# EAGLE design E-meter (EAGLE 7.4.0)
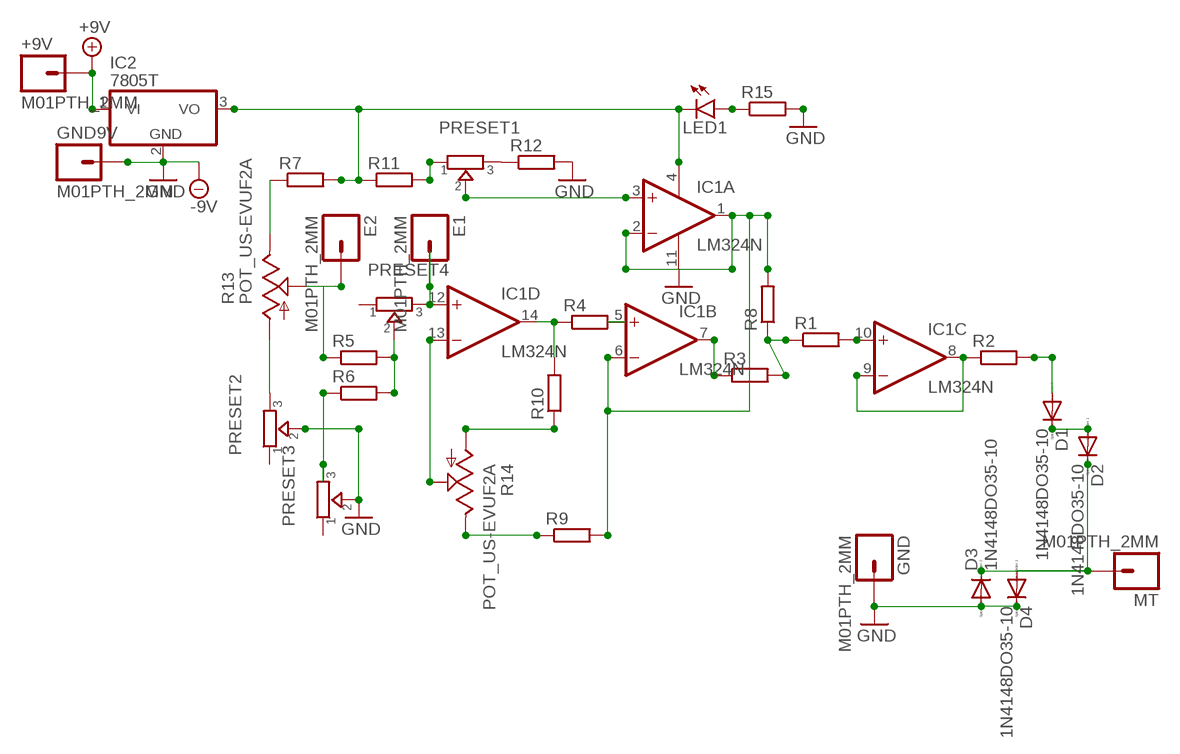
[diagram p0: schematic, sheet 1]

## Parts
+9V  M01PTH_2MM  [1X01_2MM]
D1  1N4148DO35-10  [DO35-10]
D2  1N4148DO35-10  [DO35-10]
D3  1N4148DO35-10  [DO35-10]
D4  1N4148DO35-10  [DO35-10]
E1  M01PTH_2MM  [1X01_2MM]
E2  M01PTH_2MM  [1X01_2MM]
GND  M01PTH_2MM  [1X01_2MM]
GND9V  M01PTH_2MM  [1X01_2MM]
IC1  LM324N  [DIL14]
IC2  7805T  [TO220H]
LED1  LED5MM  [LED5MM]
MT  M01PTH_2MM  [1X01_2MM]
PRESET1  TRIMMER-3306F  [TRIMMER_3306F]
PRESET2  TRIMMER-3306F  [TRIMMER_3306F]
PRESET3  TRIMMER-3306F  [TRIMMER_3306F]
PRESET4  TRIMMER-3306F  [TRIMMER_3306F]
R1  R-EU_0207/10  [0207/10]
R2  R-EU_0207/10  [0207/10]
R3  R-EU_0207/10  [0207/10]
R4  R-EU_0207/10  [0207/10]
R5  R-EU_0207/10  [0207/10]
R6  R-EU_0207/10  [0207/10]
R7  R-EU_0207/10  [0207/10]
R8  R-EU_0207/10  [0207/10]
R9  R-EU_0207/10  [0207/10]
R10  R-EU_0207/10  [0207/10]
R11  R-EU_0207/10  [0207/10]
R12  R-EU_0207/10  [0207/10]
R13  POT_US-EVUF2A  [POT_EVUF]
R14  POT_US-EVUF2A  [POT_EVUF]
R15  R-EU_0207/10  [0207/10]

## Nets
+9V: +9V.1 IC2.1(VI)
GND: D3.A D4.C GND9V.1 GND.1 IC1.11(P:V-) IC2.2(GND) PRESET2.2 PRESET3.2 R12.2 R15.2 ; supply symbol labelled -9V
N$1: E2.1 R5.1 R13.2(S)
N$2: IC1.10(C:+IN) R1.2
N$3: IC1.7(B:OUT) R3.1
N$4: IC1.1(A:OUT) IC1.2(A:-IN) IC1.6(B:-IN) R8.2 R9.2
N$5: IC1.5(B:+IN) R4.2
N$6: IC1.14(D:OUT) R4.1 R10.2
N$7: IC1.8(C:OUT) IC1.9(C:-IN) R2.1
N$8: D1.A R2.2
N$9: E1.1 IC1.12(D:+IN) PRESET4.3
N$10: D1.C D2.A
N$11: D2.C D3.C D4.A MT.1
N$12: IC1.3(A:+IN) PRESET1.2
N$13: PRESET1.1 R11.2
N$14: IC1.4(P:V+) IC2.3(VO) LED1.K(C) R7.2 R11.1
N$15: R7.1 R13.3(E)
N$16: PRESET1.3 R12.1
N$17: R10.1 R14.1(A)
N$19: PRESET2.3 R13.1(A)
N$20: IC1.13(D:-IN) R14.2(S)
N$21: R9.1 R14.3(E)
N$22: R1.1 R3.2 R8.1
N$23: PRESET4.2 R5.2 R6.2
N$24: PRESET3.3 R6.1
N$26: LED1.A R15.1
Unconnected: PRESET2.1 PRESET3.1 PRESET4.1

## Library data of the parts
+9V E1 E2 GND GND9V MT = SparkFun-Connectors:M01: Header 1 Standard 1-pin 0.1" header. Use with straight break away headers (SKU : PRT-00116), right angle break away headers (PRT-00553), swiss pins (PRT-00743), machine pins (PRT-00117), and female headers (PRT-00115).
D1-D4 = diode:1N4148: DIODE high speed (Philips)
IC1 = linear:LM324: OP AMP
IC2 = linear:78*: Positive VOLTAGE REGULATOR Source: http://cache.national.com/ds/LM/LM78L05.pdf http://www.fairchildsemi.com/ds/LM/LM7805.pdf
LED1 = SparkFun-LED:LED: LEDs Standard schematic elements and footprints for 5mm, 3mm, 1206, and 0603 sized LEDs. 5mm - Spark Fun Electronics SKU : COM-00529 (and others)
PRESET1-PRESET4 = dp_devices:TRIMMER: Trimmer resistor
R1-R12 R15 = rcl:R-EU_: RESISTOR, European symbol
R13 R14 = 4009dist_PWM3_v1:POT_US-EVU: 9 mm Square Rotary Potentiometers Source: Panasonic

## Board
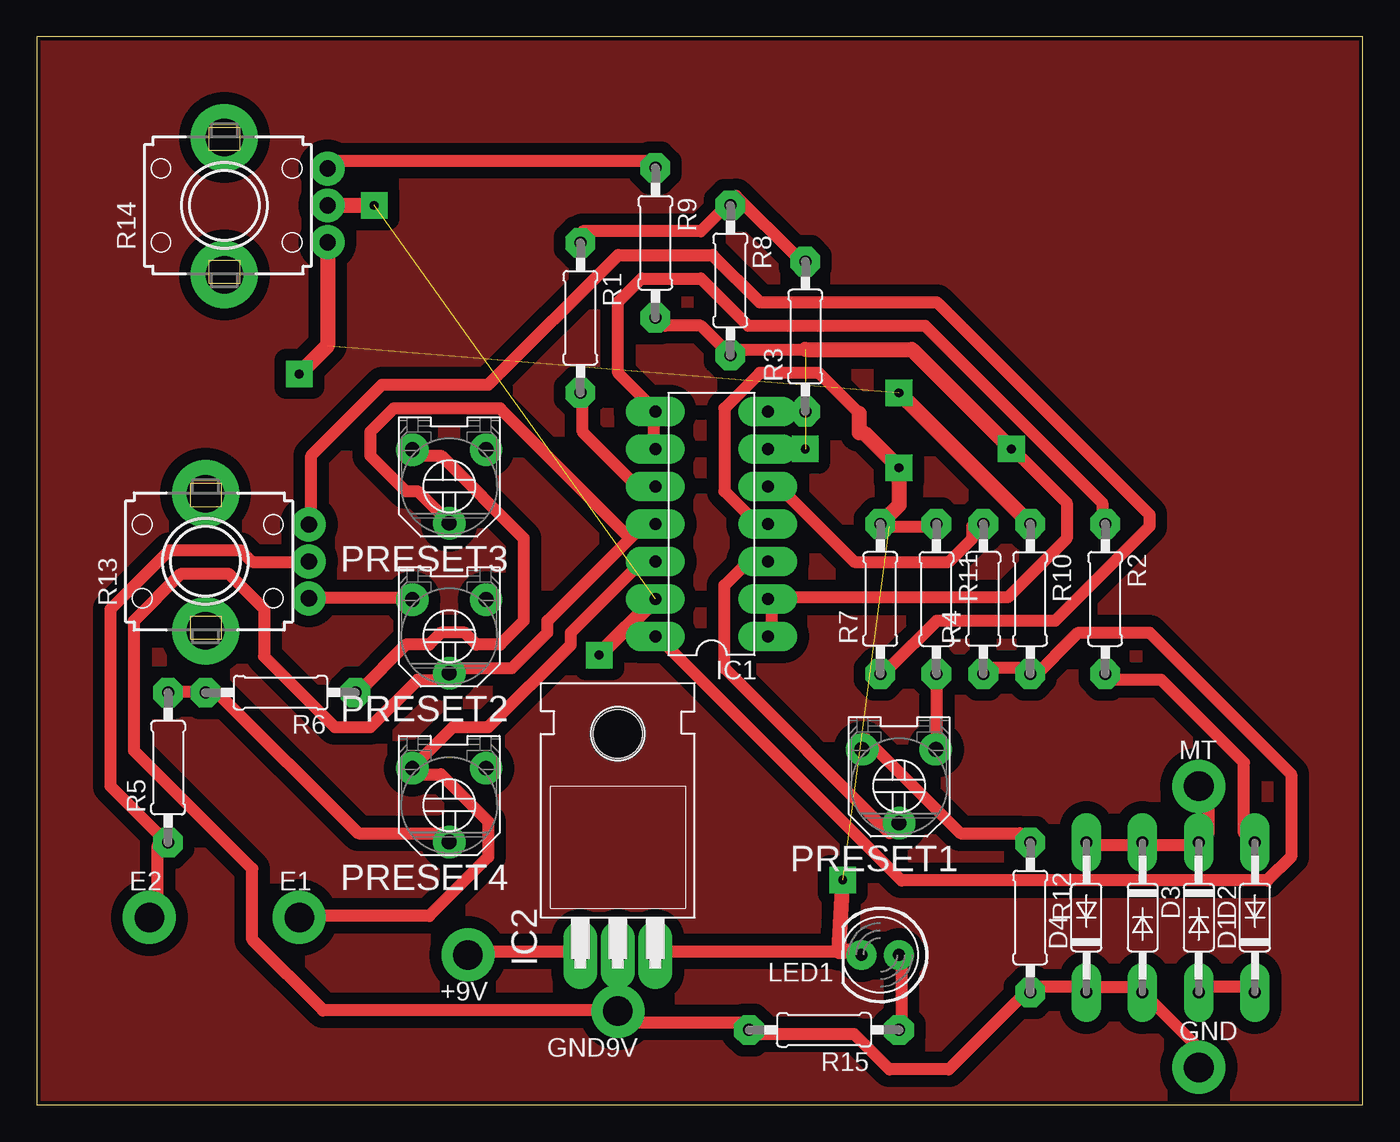
[diagram p1: board, top side]

Size 89.84 x 72.38 mm. Coordinates in mm from the lower left corner, seen from the top.
Outline: 0,0 89.84,0 89.84,72.38 0,72.38 0,0
Copper layers (1*16): Top 0.035mm / dielectric 1.5mm / Bottom 0.035mm
Design rules "hobby": minimum track width 0.8mm, minimum drill 0.8mm, track to track 0.8mm, track to pad 0.8mm, pad to pad 0.45mm, via to via 0.8mm, smd to smd 8mil, copper to edge 10mil, drill to drill 8mil, minimum pad ring 0.6mm, minimum via ring 0.6mm, stop-mask expansion 0mil, vias tented up to drill 0mil, thermal gap 10mil

### Footprints (pad centres in the part's own frame; a part is rotated, then mirrored left to right if it is on the bottom)
1X01_2MM = drill 2 pad 3.302: 1 0,0
DO35-10 = drill 0.813 long: A 5.08,0; C -5.08,0
DIL14 = drill 0.813 long: 1 -7.62,-3.81; 2 -5.08,-3.81; 3 -2.54,-3.81; 4 0,-3.81; 5 2.54,-3.81; 6 5.08,-3.81; 7 7.62,-3.81; 8 7.62,3.81; 9 5.08,3.81; 10 2.54,3.81; 11 0,3.81; 12 -2.54,3.81; 13 -5.08,3.81; 14 -7.62,3.81
TO220H = drill 1.118 long: 1 -2.54,-10.16; 2 0,-10.16; 3 2.54,-10.16 | hole 3.302: 0,4.826
LED5MM = drill 0.813 pad 1.88: A -1.27,0; K 1.27,0
TRIMMER_3306F = drill 1: 1 -2.5,-2.5; 2 0,2.5; 3 2.5,-2.5
0207/10 = drill 0.813 octagon: 1 -5.08,0; 2 5.08,0
POT_EVUF = drill 1.1 pad 1.93: 1 -2.5,-7; 2 0,-7; 3 2.5,-7 | drill 2.54 pad 3.81: M1 4.6,0; M2 -4.7,0

### Placement (x,y rotation side)
+9V  29.21,10.16 180 top
D1  82.55,12.7 90 top
D2  78.74,12.7 270 top
D3  74.93,12.7 270 top
D4  71.12,12.7 90 top
E1  17.78,12.7 0 top
E2  7.62,12.7 0 top
GND  78.74,2.54 0 top
GND9V  39.37,6.35 180 top
IC1  45.72,39.37 90 top
IC2  39.37,20.32 0 top
LED1  57.15,10.16 180 top
MT  78.74,21.59 0 top
PRESET1  58.42,21.59 180 top
PRESET2  27.94,31.75 180 top
PRESET3  27.94,41.91 180 top
PRESET4  27.94,20.32 180 top
R1  36.83,53.34 270 top
R2  72.39,34.29 270 top
R3  52.07,52.07 90 top
R4  64.13,34.29 90 top
R5  8.89,22.86 90 top
R6  16.51,27.94 180 top
R7  57.15,34.29 90 top
R8  46.99,55.88 270 top
R9  41.91,58.42 270 top
R10  67.31,34.29 270 top
R11  60.96,34.29 270 top
R12  67.31,12.7 270 top
R13  11.43,36.83 90 top
R14  12.7,60.96 90 top
R15  53.34,5.08 180 top

### Tracks (layer width: path | path; a pad name or v marks a point on that pad's centre or on a via)
+9V
  Top 0.8: IC2.1 36.19,10.4 29.79,10.4 +9V.1
GND
  Top 0.8: 40.19,38.4 34.59,32.8 34.59,32 32.19,29.6 28.19,29.6 PRESET2.2 27.39,28.8 25.79,28.8 22.59,25.6 20.19,25.6 15.39,30.4 15.39,33.6 12.99,36 9.79,36 6.59,32.8 6.59,24 14.59,16 14.59,11.2 19.39,6.4 38.59,6.4 GND9V.1 | 40.19,38.4 40.99,39.2 41.79,39.2 IC1.11 | 40.19,38.4 31.39,47.2 24.19,47.2 22.59,45.6 22.59,44 24.99,41.6 25.79,41.6 27.39,40 PRESET3.2 | GND9V.1 39.39,5.6 48.19,5.6 R15.2 48.99,4.8 55.39,4.8 57.79,2.4 61.79,2.4 66.59,7.2 R12.2 67.39,8 70.59,8 D4.C 71.39,8 74.59,8 D3.A 75.39,7.2 79.39,3.2 GND.1 | IC2.2 39.39,9.6 39.39,6.4 GND9V.1
N$1
  Top 0.8: E2.1 8.19,12.8 8.19,17.6 R5.1 8.19,18.4 4.99,21.6 4.99,33.6 8.99,37.6 13.79,37.6 14.59,36.8 17.79,36.8 R13.2
N$2
  Top 0.8: R1.2 36.99,48 36.99,45.6 40.99,41.6 41.79,41.6 IC1.10
N$3
  Top 0.8: IC1.7 49.79,47.2 51.39,47.2 R3.1
N$4  (1 unrouted)
  Top 0.8: IC1.1 49.79,32 49.79,33.6 IC1.2 49.79,34.4 65.79,34.4 69.79,38.4 69.79,40.8 59.39,51.2 52.07,51.2 47.39,51.2 R8.2 44.99,52.8 42.59,52.8 R9.2
  Top 1.016: IC1.6 52.07,44.45 | 52.07,51.2 59.29,51.2 66.04,44.45
N$5
  Top 0.8: R4.2 63.39,39.2 63.39,38.4 61.79,36.8 55.39,36.8 50.59,41.6 49.79,41.6 IC1.5
N$6
  Top 0.8: R4.1 64.19,29.6 66.59,29.6 R10.2 67.39,28.8 70.59,32 75.39,32 84.99,22.4 84.99,16.8 83.39,15.2 58.59,15.2 42.59,31.2 IC1.14
N$7
  Top 0.8: IC1.9 41.79,44.8 41.79,46.4 IC1.8 41.79,47.2 39.39,49.6 39.39,54.4 40.99,56 44.99,56 48.19,52.8 60.19,52.8 72.19,40.8 72.19,40 R2.1
N$8
  Top 0.8: R2.2 72.99,28.8 76.19,28.8 81.79,23.2 81.79,18.4 D1.A
N$9
  Top 0.8: IC1.12 41.79,36.8 40.99,36.8 36.19,32 36.19,31.2 30.59,25.6 28.19,25.6 25.79,23.2 PRESET4.3 25.79,22.4 27.39,22.4 30.59,19.2 30.59,16.8 26.59,12.8 17.79,12.8 E1.1
N$10
  Top 0.8: D2.A 79.39,8 81.79,8 D1.C
N$11
  Top 0.8: D4.A 71.39,17.6 74.59,17.6 D3.C 75.39,17.6 78.59,17.6 D2.C 79.39,18.4 79.39,20.8 MT.1
N$12
  Top 0.8: IC1.3 48.99,36.8 48.19,36.8 46.59,35.2 46.59,29.6 57.79,18.4 PRESET1.2
N$13
  Top 0.8: R11.2 60.99,28.8 60.99,24.8 PRESET1.1
N$14  (1 unrouted)
  Top 0.8: 55.72,46.87 52.99,49.6 48.99,49.6 46.59,47.2 46.59,41.6 48.99,39.2 IC1.4 | 56.99,40 R7.2 57.79,39.2 60.19,39.2 R11.1 | 54.37,10.4 42.59,10.4 IC2.3 | 55.39,10.4 LED1.K
  Top 1.016: 55.39,10.4 54.37,10.4 54.61,15.24 | 48.99,39.2 49.36,39.2 IC1.4 | 55.72,46.87 55.72,45.56 56.04,45.56 58.42,43.18 58.42,40.64 R7.2
N$15
  Top 0.8: R7.1 57.79,29.6 60.99,32.8 68.99,32.8 75.39,39.2 75.39,40 60.99,54.4 48.99,54.4 45.79,57.6 39.39,57.6 30.59,48.8 23.39,48.8 18.59,44 18.59,40 R13.3
N$16
  Top 0.8: R12.1 66.59,18.4 62.59,18.4 56.19,24.8 PRESET1.3
N$17  (1 unrouted)
  Top 1.016: R14.1 19.7,51.45 17.78,49.53 | R10.1 58.42,48.26
N$18  (via drill 0.6)
  other vias: 58.42,48.26
N$19
  Top 0.8: PRESET2.3 24.99,34.4 18.59,34.4 R13.1
N$20  (1 unrouted)
  Top 1.016: R14.2 22.86,60.96 | IC1.13 38.1,30.48
N$21
  Top 0.8: R9.1 41.79,64 20.19,64 R14.3
N$22
  Top 0.8: R1.1 36.99,59.2 44.99,59.2 46.59,60.8 R8.1 47.39,61.6 51.39,57.6 R3.2
N$23
  Top 0.8: R5.2 8.99,28 11.39,28 R6.2 12.19,28 21.79,18.4 27.39,18.4 PRESET4.2
N$24
  Top 0.8: R6.1 21.79,28 24.99,31.2 26.59,31.2 27.39,32 28.99,32 29.79,31.2 31.39,31.2 32.99,32.8 32.99,38.4 27.39,44 25.79,44 PRESET3.3
N$25  (via drill 0.6)
  other vias: 17.78,49.53
N$26
  Top 0.8: R15.1 58.59,5.6 58.59,9.6 LED1.A
N$27  (via drill 0.6)
  other vias: 58.42,43.18
N$28  (via drill 0.6)
  other vias: 54.61,15.24
N$29  (via drill 0.6)
  other vias: 52.07,44.45
N$30  (via drill 0.6)
  other vias: 66.04,44.45
N$31  (via drill 0.6)
  other vias: 38.1,30.48
N$32  (via drill 0.6)
  other vias: 22.86,60.96
N$33
  pour Top: 0,72.39 0,0 90.17,0 90.17,72.39